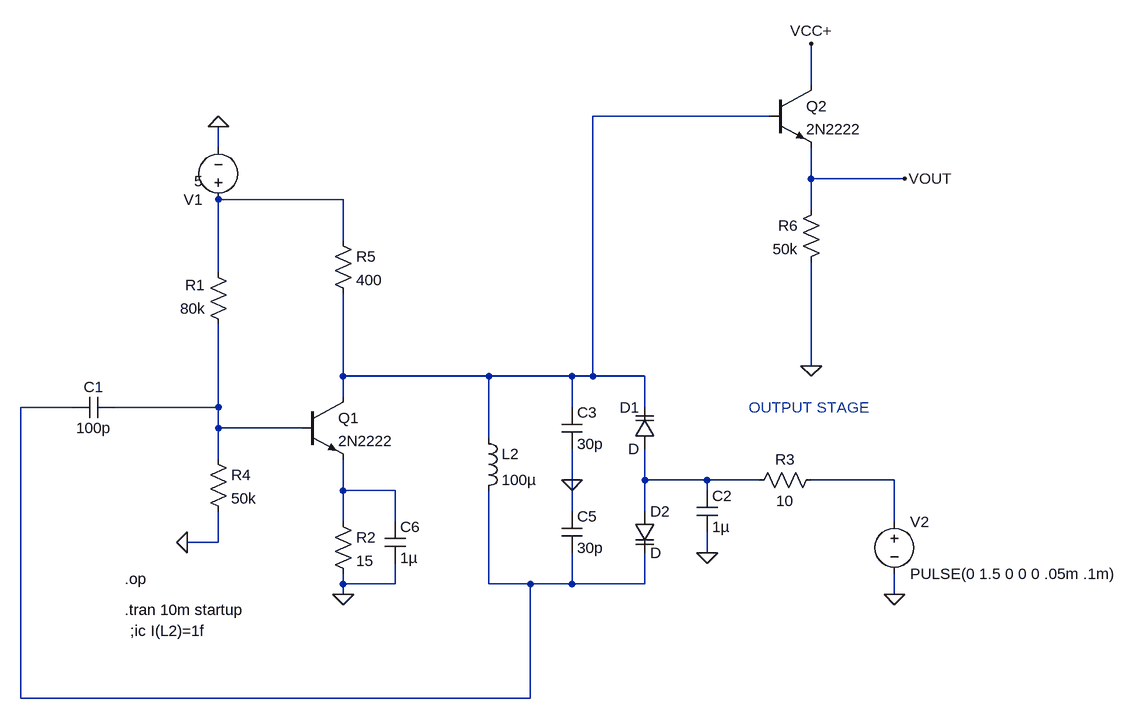
[diagram p0: schematic osc-colpin-varactor.asc]
osc-colpin-varactor.asc, the LTspice schematic file:
Version 4
SHEET 1 1400 680
WIRE 912 -400 912 -464
WIRE 848 -352 576 -352
WIRE 0 -304 0 -336
WIRE 912 -256 912 -304
WIRE 1056 -256 912 -256
WIRE 192 -224 0 -224
WIRE 912 -208 912 -256
WIRE 192 -160 192 -224
WIRE 0 -112 0 -224
WIRE 912 32 912 -128
WIRE 192 48 192 -80
WIRE 416 48 192 48
WIRE 544 48 416 48
WIRE 576 48 576 -352
WIRE 576 48 544 48
WIRE 656 48 576 48
WIRE 192 80 192 48
WIRE -224 96 -304 96
WIRE 0 96 0 -32
WIRE 0 96 -160 96
WIRE 544 96 544 48
WIRE 656 96 656 48
WIRE 0 128 0 96
WIRE 128 128 0 128
WIRE 416 144 416 48
WIRE 0 176 0 128
WIRE 544 208 544 160
WIRE 656 208 656 160
WIRE 752 208 656 208
WIRE 832 208 752 208
WIRE 1040 208 912 208
WIRE 192 224 192 176
WIRE 272 224 192 224
WIRE 752 224 752 208
WIRE 544 256 544 208
WIRE 656 256 656 208
WIRE 192 272 192 224
WIRE 272 272 272 224
WIRE 1040 272 1040 208
WIRE 0 304 0 256
WIRE 0 304 -48 304
WIRE 752 320 752 288
WIRE 192 368 192 352
WIRE 272 368 272 336
WIRE 272 368 192 368
WIRE 416 368 416 224
WIRE 480 368 416 368
WIRE 544 368 544 320
WIRE 544 368 480 368
WIRE 656 368 656 320
WIRE 656 368 544 368
WIRE 192 384 192 368
WIRE 1040 384 1040 352
WIRE -304 544 -304 96
WIRE 480 544 480 368
WIRE 480 544 -304 544
FLAG 0 -336 0
FLAG 192 384 0
FLAG -48 304 0
FLAG 544 208 0
FLAG 1040 384 0
FLAG 752 320 0
FLAG 912 -464 VCC+
FLAG 912 32 0
FLAG 1056 -256 VOUT
DATAFLAG 592 464 ""
DATAFLAG 192 224 ""
DATAFLAG 80 128 ""
SYMBOL res 16 -16 R180
WINDOW 0 36 76 Left 2
WINDOW 3 36 40 Left 2
SYMATTR InstName R1
SYMATTR Value 80k
SYMBOL voltage 0 -208 R180
WINDOW 3 24 44 Left 2
WINDOW 123 0 0 Left 0
WINDOW 39 0 0 Left 0
SYMATTR Value 5
SYMATTR InstName V1
SYMBOL res -16 160 R0
SYMATTR InstName R4
SYMATTR Value 50k
SYMBOL cap 528 96 R0
SYMATTR InstName C3
SYMATTR Value 30p
SYMBOL cap 528 256 R0
SYMATTR InstName C5
SYMATTR Value 30p
SYMBOL ind 400 128 R0
SYMATTR InstName L2
SYMATTR Value 100µ
SYMBOL res 176 256 R0
SYMATTR InstName R2
SYMATTR Value 15
SYMBOL cap 256 272 R0
SYMATTR InstName C6
SYMATTR Value 1µ
SYMBOL res 176 -176 R0
SYMATTR InstName R5
SYMATTR Value 400
SYMBOL cap -160 80 R90
WINDOW 0 0 32 VBottom 2
WINDOW 3 32 32 VTop 2
SYMATTR InstName C1
SYMATTR Value 100p
SYMBOL npn 128 80 R0
SYMATTR InstName Q1
SYMATTR Value 2N2222
SYMBOL voltage 1040 256 R0
WINDOW 123 0 0 Left 0
WINDOW 39 0 0 Left 0
SYMATTR InstName V2
SYMATTR Value PULSE(0 1.5 0 0 0 .05m .1m)
SYMBOL varactor 672 160 R180
WINDOW 0 24 64 Left 2
WINDOW 3 24 0 Left 2
SYMATTR InstName D1
SYMBOL varactor 640 256 R0
SYMATTR InstName D2
SYMBOL cap 736 224 R0
SYMATTR InstName C2
SYMATTR Value 1µ
SYMBOL res 928 192 R90
WINDOW 0 0 56 VBottom 2
WINDOW 3 32 56 VTop 2
SYMATTR InstName R3
SYMATTR Value 10
SYMBOL npn 848 -400 R0
SYMATTR InstName Q2
SYMATTR Value 2N2222
SYMBOL res 928 -224 M0
SYMATTR InstName R6
SYMATTR Value 50k
TEXT -144 360 Left 2 !.op
TEXT -144 408 Left 2 !.tran 10m startup
TEXT -136 440 Left 2 !;ic I(L2)=1f
TEXT 816 96 Left 2 ;OUTPUT STAGE

The netlist it stands for:
* osc-colpin-varactor.asc
R1 N004 N002 80k
V1 N002 0 5
R4 N004 0 50k
C3 N001 0 30p
C5 0 N003 30p
L2 N001 N003 100µ
R2 N007 0 15
C6 N007 0 1µ
R5 N002 N001 400
C1 N004 N003 100p
Q1 N001 N004 N007 0 2N2222
V2 N006 0 PULSE(0 1.5 0 0 0 .05m .1m)
D1 N005 N001 D
D2 N005 N003 D
C2 N005 0 1µ
R3 N006 N005 10
Q2 VCC+ N001 VOUT 0 2N2222
R6 VOUT 0 50k
.model D D
.lib standard.dio
.model NPN NPN
.model PNP PNP
.lib standard.bjt
.op
.tran 10m startup
;ic I(L2)=1f
* OUTPUT STAGE
.backanno
.end